# Altium schematic sheet Sheet_3.schdoc
size 306 x 126 mm
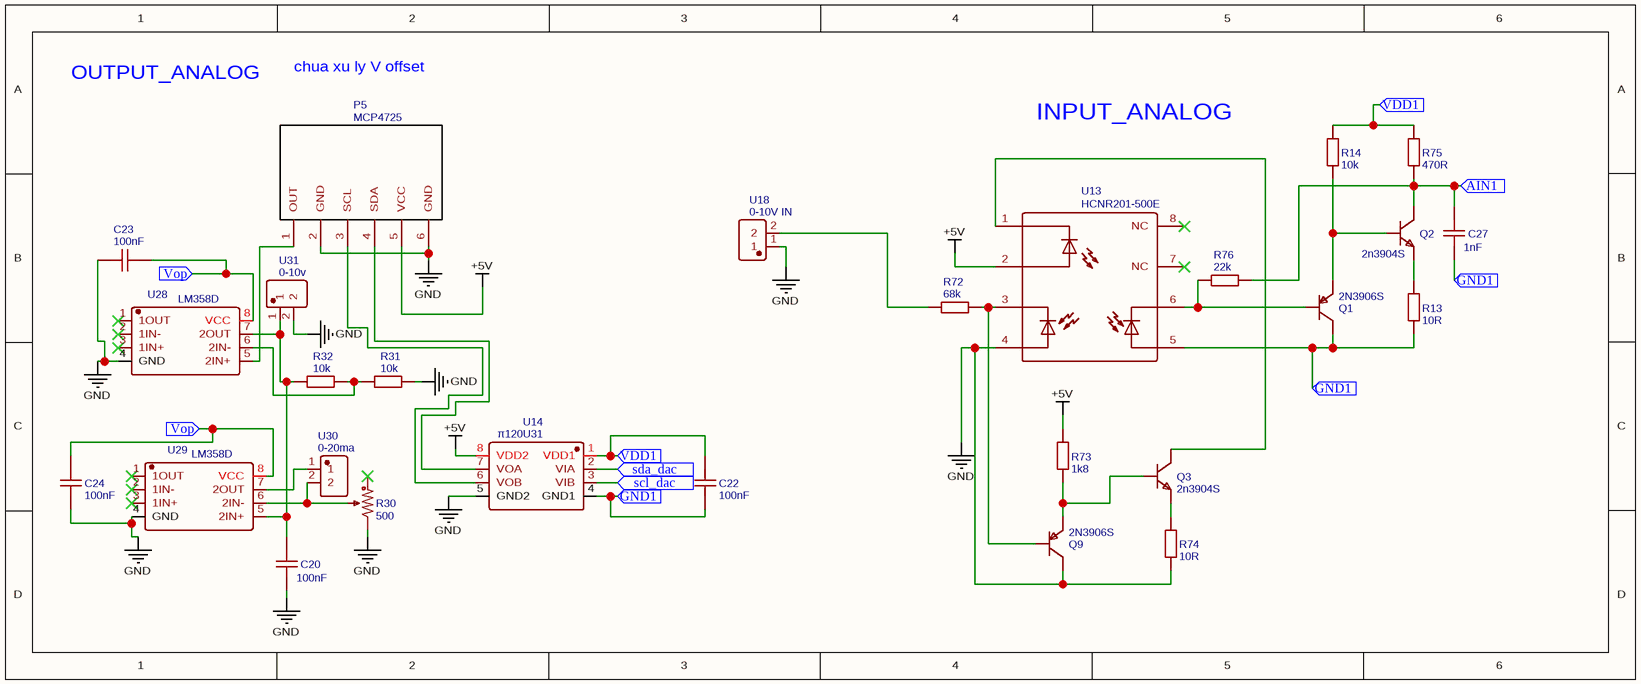
[diagram p0: Sheet_3.schdoc]

## Parts
C20  100nF  [C1206]
C22  100nF  [C1206]
C23  100nF  [C1206]
C24  100nF  [C1206]
C27  1nF  [C1206]
P5  MCP4725  [MCP4725 CHINESE BOARD 0X60H]
Q1  2N3906S  [SOT-23-3_L2.9-W1.5-P1.90-LS2.6-TR]
Q2  2n3904S  [SOT-23-3_L2.9-W1.3-P1.90-LS2.4-TR]
Q3  2n3904S  [SOT-23-3_L2.9-W1.3-P1.90-LS2.4-TR]
Q9  2N3906S  [SOT-23-3_L2.9-W1.5-P1.90-LS2.6-TR]
R13  10R  [R1206]
R14  10k  [R1206]
R30  500  [RES-ADJ-TH_3P-L9.5-W4.85-P2.50-BL-BS]
R31  10k  [R1206]
R32  10k  [R1206]
R72  68k  [R1206]
R73  1k8  [R1206]
R74  10R  [R1206]
R75  470R  [R1206]
R76  22k  [R1206]
U13  HCNR201-500E  [OPTO-SMD-8P_L11.0-W9.0-P2.54-LS12.4-BL]
U14  π120U31  [SOIC-8_L5.0-W4.0-P1.27-LS6.0-BL]
U18  0-10V IN  [CONN-TH_DG127-5.08-02P-14-02A]
U28  LM358D  [SOIC-8_L5.0-W4.0-P1.27-LS6.0-BL]
U29  LM358D  [SOIC-8_L5.0-W4.0-P1.27-LS6.0-BL]
U30  0-20ma  [CONN-TH_DG127-5.08-02P-14-02A]
U31  0-10v  [CONN-TH_DG127-5.08-02P-14-02A]

## Ports
AIN1 (in), GND1 (in), scl_dac (in), sda_dac (in), VDD1 (in), Vop (in)

## Nets
+5V: P5.5(VCC) R73.2 U13.2(L_AN) U14.8(VDD2)
GND: C20.2 C23.2 C24.1 P5.2(GND) P5.6(GND) Q9.3(C) R30.3 R31.2 R74.1 U13.4(PD1_AN) U14.5(GND2) U18.1 U28.4(GND) U29.4(GND) U31.2
AIN1: C27.1 Q2.3(C) R75.1 R76.1 ; port AIN1
GND1: C22.2 C27.2 Q1.3(C) R13.1 U13.5(PD2_AN) U14.4(GND1) ; port GND1
scl_dac: U14.3(VIB) ; port scl_dac
sda_dac: U14.2(VIA) ; port sda_dac
VDD1: C22.1 R14.2 R75.2 U14.1(VDD1) ; port VDD1
Vop: C23.1 C24.2 U28.8(VCC) U29.8(VCC) ; port Vop
NetC20_1: C20.1 R32.2 U28.7(2OUT) U29.5(2IN+) U31.1
NetP5_1: P5.1(OUT) U28.5(2IN+)
NetP5_3: P5.3(SCL) U14.6(VOB)
NetP5_4: P5.4(SDA) U14.7(VOA)
NetQ1_1: Q1.1(E) Q2.2(B) R14.1
NetQ1_2: Q1.2(B) R76.2 U13.6(PD2_CAT)
NetQ2_1: Q2.1(E) R13.2
NetQ3_1: Q3.1(E) R74.2
NetQ3_2: Q3.2(B) Q9.1(E) R73.1
NetQ3_3: Q3.3(C) U13.1(L_CAT)
NetQ9_2: Q9.2(B) R72.1 U13.3(PD1_CAT)
NetR30_2: R30.2 U29.6(2IN-) U30.2
NetR31_1: R31.1 R32.1 U28.6(2IN-)
NetR72_2: R72.2 U18.2
NetU29_7: U29.7(2OUT) U30.1

Not connected (* = marked no-connect by the designer): R30 1*; U13 7(NC)* 8(NC)*; U28 1(1OUT)* 2(1IN-)* 3(1IN+)*; U29 1(1OUT)* 2(1IN-)* 3(1IN+)*

## Notes on the sheet
- OUTPUT_ANALOG
- chua xu ly V offset
- INPUT_ANALOG

## Library data of the parts
C20 C22-C24 = 100nF: BOM_Manufacturer: Dersonic; BOM_Manufacturer Part: CC1H333ZA1PD3F4D30MF; nameAlias: Capacitance; Contributor: LCSC; BOM_Supplier: LCSC; BOM_Supplier Part: C254075; BOM_JLCPCB Part Class: Extended Part; spicePre: C; spiceSymbolName: CC1H333ZA1PD3F4D30MF
C27 = 1nF: BOM_Manufacturer: Dersonic; BOM_Manufacturer Part: CC1H333ZA1PD3F4D30MF; nameAlias: Capacitance; Contributor: LCSC; BOM_Supplier: LCSC; BOM_Supplier Part: C254075; BOM_JLCPCB Part Class: Extended Part; spicePre: C; spiceSymbolName: CC1H333ZA1PD3F4D30MF
P5 = MCP4725: Contributor: amsgomes_9956; BOM_Manufacturer Part: MCP4725; spicePre: P; spiceSymbolName: MCP4725
Q1 Q9 = 2N3906S: BOM_Manufacturer: KEC; BOM_Manufacturer Part: 2N3906S-RTK/H; Contributor: LCSC; BOM_Supplier: LCSC; BOM_Supplier Part: C2837301; spicePre: Q; spiceSymbolName: 2N3906S-RTK/H
Q2 Q3 = 2n3904S: BOM_Manufacturer: KEC; BOM_Manufacturer Part: 2n3904S-RTK/PS; BOM_Supplier: LCSC; BOM_Supplier Part: C18536; BOM_JLCPCB Part Class: Extended Part; spicePre: Q; spiceSymbolName: 2n3904S-RTK/PS_C18536
R13 R74 = 10R: BOM_Manufacturer: Chian Chia Elec; nameAlias: Resistance (Ohms); Contributor: LCSC; BOM_Supplier: LCSC; BOM_Supplier Part: C120038; BOM_Manufacturer Part: -; BOM_JLCPCB Part Class: Extended Part; spicePre: R; spiceSymbolName: CF1/4W-200Ω±5% T52
R14 R31 R32 = 10k: BOM_Manufacturer: Chian Chia Elec; nameAlias: Resistance (Ohms); Contributor: LCSC; BOM_Supplier: LCSC; BOM_Supplier Part: C120038; BOM_Manufacturer Part: -; BOM_JLCPCB Part Class: Extended Part; spicePre: R; spiceSymbolName: CF1/4W-200Ω±5% T52
R30 = 500: BOM_Manufacturer: Chengdu Guosheng Tech; BOM_Manufacturer Part: 3296W-1-501; nameAlias: Resistance (Ohms); Contributor: LCSC; BOM_Supplier: LCSC; BOM_Supplier Part: C118913; Resistance(Ohms): 500; BOM_JLCPCB Part Class: Extended Part; spicePre: R; spiceSymbolName: 3296W-1-501_C118913
R72 = 68k: BOM_Manufacturer: Chian Chia Elec; nameAlias: Resistance (Ohms); Contributor: LCSC; BOM_Supplier: LCSC; BOM_Supplier Part: C120038; BOM_Manufacturer Part: -; BOM_JLCPCB Part Class: Extended Part; spicePre: R; spiceSymbolName: CF1/4W-200Ω±5% T52
R73 = 1k8: BOM_Manufacturer: Chian Chia Elec; nameAlias: Resistance (Ohms); Contributor: LCSC; BOM_Supplier: LCSC; BOM_Supplier Part: C120038; BOM_Manufacturer Part: -; BOM_JLCPCB Part Class: Extended Part; spicePre: R; spiceSymbolName: CF1/4W-200Ω±5% T52
R75 = 470R: BOM_Manufacturer: Chian Chia Elec; nameAlias: Resistance (Ohms); Contributor: LCSC; BOM_Supplier: LCSC; BOM_Supplier Part: C120038; BOM_Manufacturer Part: -; BOM_JLCPCB Part Class: Extended Part; spicePre: R; spiceSymbolName: CF1/4W-200Ω±5% T52
R76 = 22k: BOM_Manufacturer: Chian Chia Elec; nameAlias: Resistance (Ohms); Contributor: LCSC; BOM_Supplier: LCSC; BOM_Supplier Part: C120038; BOM_Manufacturer Part: -; BOM_JLCPCB Part Class: Extended Part; spicePre: R; spiceSymbolName: CF1/4W-200Ω±5% T52
U13 = HCNR201-500E: BOM_Manufacturer: AVAGO; BOM_Supplier: LCSC; BOM_Manufacturer Part: HCNR201-500E; BOM_Supplier Part: C27465; BOM_JLCPCB Part Class: Extended Part; spicePre: U; spiceSymbolName: HCNR201-500E
U14 = π120U31: BOM_Manufacturer: 2Pai Semi; Contributor: LCSC; BOM_Supplier: LCSC; BOM_Supplier Part: C471588; BOM_Manufacturer Part: π120U31; BOM_JLCPCB Part Class: Extended Part; spicePre: U; spiceSymbolName: π120U31
U18 = 0-10V IN: BOM_Manufacturer: DEGSON; BOM_Manufacturer Part: DG127-5.08-02P-14-02A(H); Contributor: LCSC; BOM_Supplier: LCSC; BOM_Supplier Part: C691860; spicePre: U; spiceSymbolName: DG127-5.08-02P-14-02A(H)
U28 U29 = LM358D: BOM_Manufacturer: TI; BOM_Manufacturer Part: LM358P; spicePre: X; BOM_Supplier: LCSC; BOM_Supplier Part: C5213; BOM_JLCPCB Part Class: Extended Part; spiceSymbolName: LM358P
U30 = 0-20ma: BOM_Manufacturer: DEGSON; BOM_Manufacturer Part: DG127-5.08-02P-14-02A(H); Contributor: LCSC; BOM_Supplier: LCSC; BOM_Supplier Part: C691860; spicePre: U; spiceSymbolName: DG127-5.08-02P-14-02A(H)
U31 = 0-10v: BOM_Manufacturer: DEGSON; BOM_Manufacturer Part: DG127-5.08-02P-14-02A(H); Contributor: LCSC; BOM_Supplier: LCSC; BOM_Supplier Part: C691860; spicePre: U; spiceSymbolName: DG127-5.08-02P-14-02A(H)